# EAGLE design ILX544A_V1_B2 (EAGLE 7.0.0)
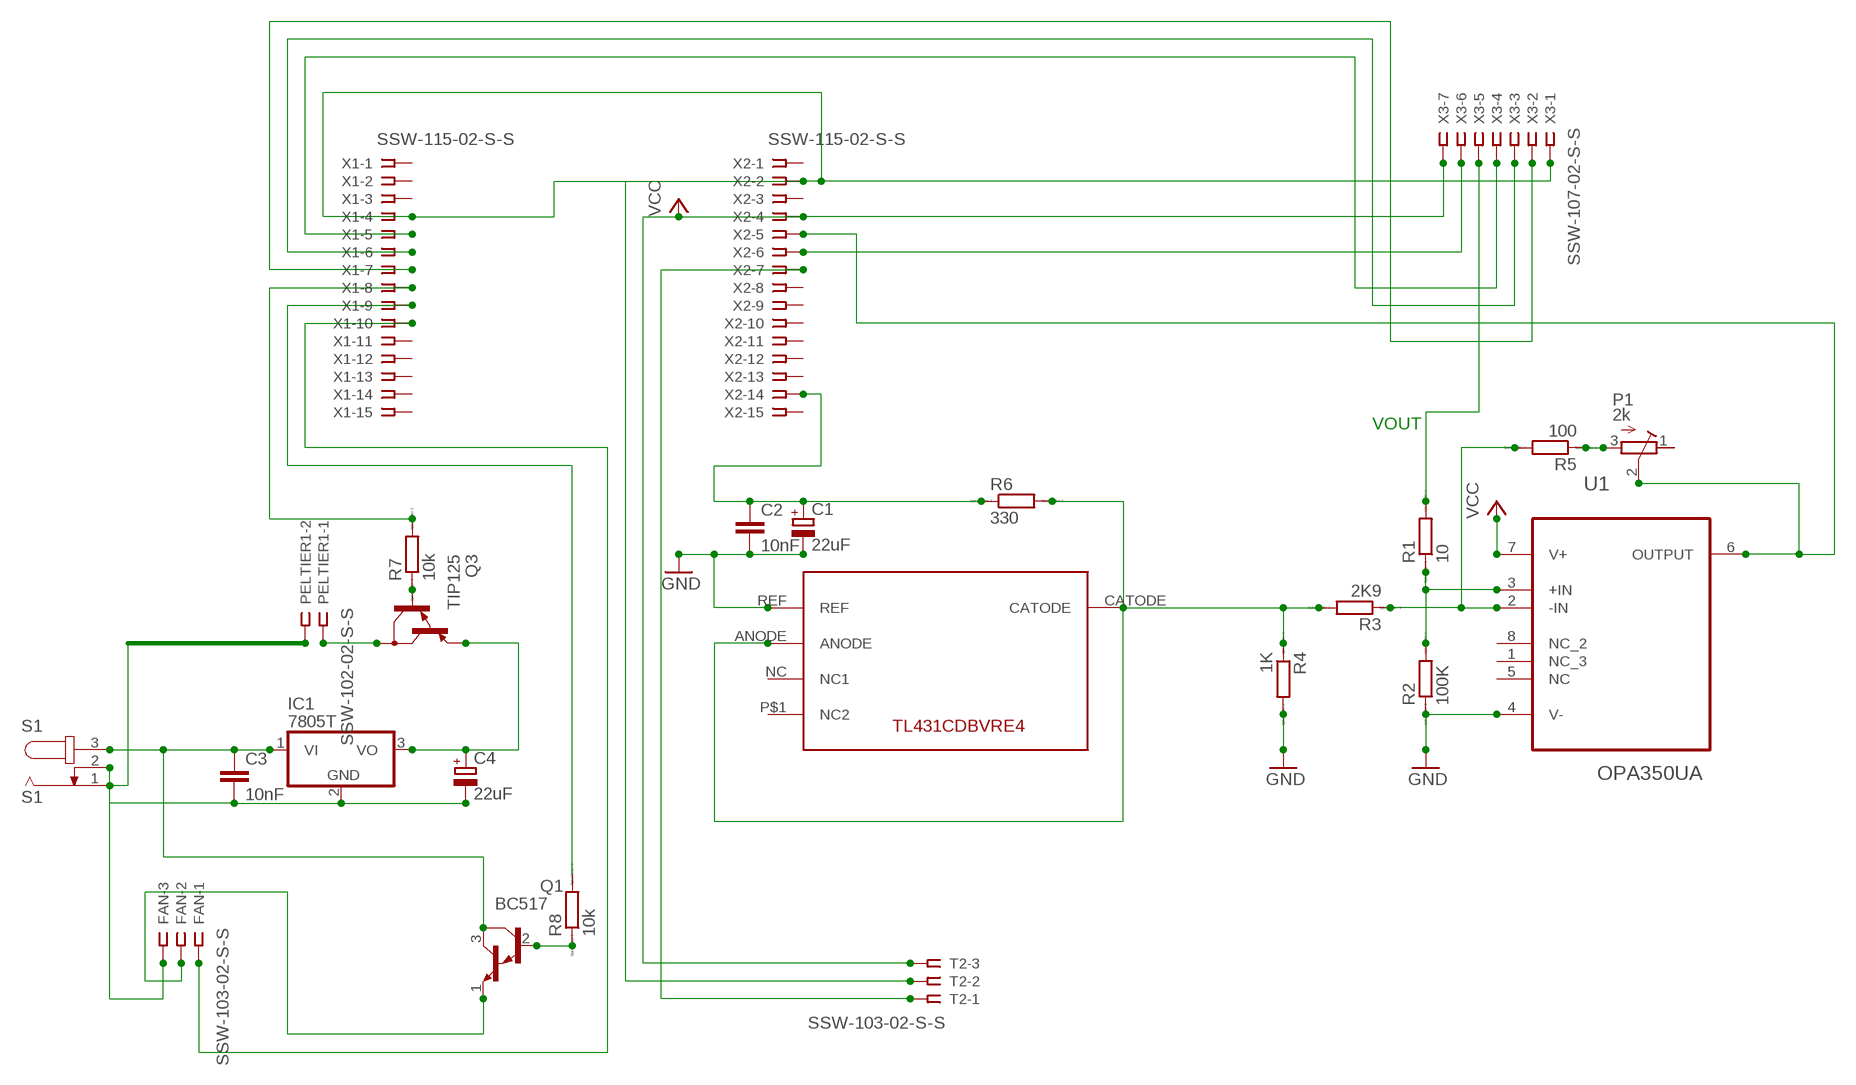
[diagram p0: schematic, sheet 1]

## Parts
C1  22uF  CPOL-EU153CLV-0505  [153CLV-0505]
C2  10nF  C-EUC0402  [C0402]
C3  10nF  C-EUC0402  [C0402]
C4  22uF  CPOL-EU153CLV-0505  [153CLV-0505]
FAN  SSW-103-02-S-S  [SSW-103-02-S-S]
IC1  7805T  [TO220H]
P1  2k  R-TRIMM43P  [RTRIM43P]
PELTIER1  SSW-102-02-S-S  [SSW-102-02-S-S]
Q1  BC517  [TO92]
Q3  TIP125  [TO220]
R1  10  RR1206  [R1206]
R2  100K  RR1206  [R1206]
R3  2K9  RR1206  [R1206]
R4  1K  RR1206  [R1206]
R5  100  RR1206  [R1206]
R6  330  RR1206  [R1206]
R7  10k  RR1206  [R1206]
R8  10k  RR1206  [R1206]
S1  S1  JACK-PLUG0  [SPC4077]
T2  SSW-103-02-S-S  [SSW-103-02-S-S]
U1  OPA350UA  [SOIC127P600X175-8N]
U$1  TL1  TL431CDBVRE4  [TL431CDBVRE4]
X1  SSW-115-02-S-S  [SSW-115-02-S-S]
X2  SSW-115-02-S-S  [SSW-115-02-S-S]
X3  SSW-107-02-S-S  [SSW-107-02-S-S]

## Nets
GND: C1.- C2.2 R2.1 R4.2 U1.4(V-) U$1.REF
N$1: P1.3(E) R5.1
N$2: R3.1 R5.2 U1.2(-IN)
N$3: R1.1 R2.2 U1.3(+IN)
N$6: R3.2 R4.1 R6.2 U$1.ANODE U$1.CATODE
N$7: P1.2(S) U1.6(OUTPUT) X2.5
N$8: C3.1 IC1.1(VI) Q1.3(C) S1.3
N$9: C4.+ IC1.3(VO) Q3.3(E)
N$10: R1.2 X3.5
N$11: PELTIER1.1 Q3.2(C)
N$13: C3.2 C4.- FAN.3 IC1.2(GND) PELTIER1.2 S1.1 S1.2
N$14: X2.6 X3.6
N$16: Q3.1(B) R7.1
N$17: X1.5 X3.4
N$18: X1.6 X3.3
N$19: X1.7 X3.2
N$20: C1.+ C2.1 R6.1 X2.14
N$22: FAN.2 Q1.1(E)
N$23: R7.2 X1.8
N$24: FAN.1 X1.10
N$25: Q1.2(B) R8.1
N$26: R8.2 X1.9
N$29: T2.2 X1.4 X2.2 X3.1
N$30: T2.1 X2.7
VCC: T2.3 U1.7(V+) X2.4 X3.7
Unconnected: P1.1(A) U1.1(NC_3) U1.5(NC) U1.8(NC_2) U$1.NC(NC1) U$1.P$1(NC2) X1.1 X1.2 X1.3 X1.11 X1.12 X1.13 X1.14 X1.15 X2.1 X2.3 X2.8 X2.9 X2.10 X2.11 X2.12 X2.13 X2.15

## Notes on the sheet
- VOUT

## Library data of the parts
C1 C4 = resistor:CPOL-EU: POLARIZED CAPACITOR, European symbol
C2 C3 = rcl:C-EU: CAPACITOR, European symbol
FAN T2 = con-samtec:SSW-103-02-S-S: THROUGH-HOLE .025" SQ POST SOCKET Source: Samtec SSW.pdf; MPN: SSW-103-02-S-S; OC_FARNELL: unknown; OC_NEWARK: 11P9367
IC1 = linear:78*: Positive VOLTAGE REGULATOR Source: http://cache.national.com/ds/LM/LM78L05.pdf http://www.fairchildsemi.com/ds/LM/LM7805.pdf
P1 = resistor:R-TRIMM: Trimm resistor
PELTIER1 = con-samtec:SSW-102-02-S-S: THROUGH-HOLE .025" SQ POST SOCKET Source: Samtec SSW.pdf; MPN: SSW-102-02-S-S; OC_FARNELL: unknown; OC_NEWARK: 11P9351
Q1 = transistor-npn:BC517*: NPN Darlington Transistor
Q3 = transistor-pnp:TIP125: PNP Transistor
R1-R8 = eagle-ltspice:R: RESISTOR, European symbol; SPICEMODEL: NONE; SPICEPREFIX: R
S1 = con-jack:JACK-PLUG: DC POWER JACK Power Jack, DC, Right Angle, Through Hole, Rated 5A at 16VDC, PC Terminals Distributor: Farnell (www.Farnell.de) Drawing: 84N1161.pdf / 84N1162.pdf Manufacturer: SPC Technology (www.spctechnology.com) Type: SPC4077 / SPC 4078; OC_FARNELL: unknown; OC_NEWARK: unknown
U1 = opa350ua:OPA350UA: High-Speed, Single-Supply, Rail-to-Rail OPERATIONAL AMPLIFIERS MicroAmplifier Series; MPN: OPA350UA; OC_FARNELL: 1106197; OC_NEWARK: 35C1894; PACKAGE: SOIC-8; SUPPLIER: Texas Instruments
U$1 = TL431CDVBRE4:TL431CDBVRE4
X1 X2 = con-samtec:SSW-115-02-S-S: THROUGH-HOLE .025" SQ POST SOCKET Source: Samtec SSW.pdf; MPN: SSW-115-02-S-S; OC_FARNELL: unknown; OC_NEWARK: 11P9564
X3 = con-samtec:SSW-107-02-S-S: THROUGH-HOLE .025" SQ POST SOCKET Source: Samtec SSW.pdf; MPN: SSW-107-02-S-S; OC_FARNELL: unknown; OC_NEWARK: 11P9433

## Board
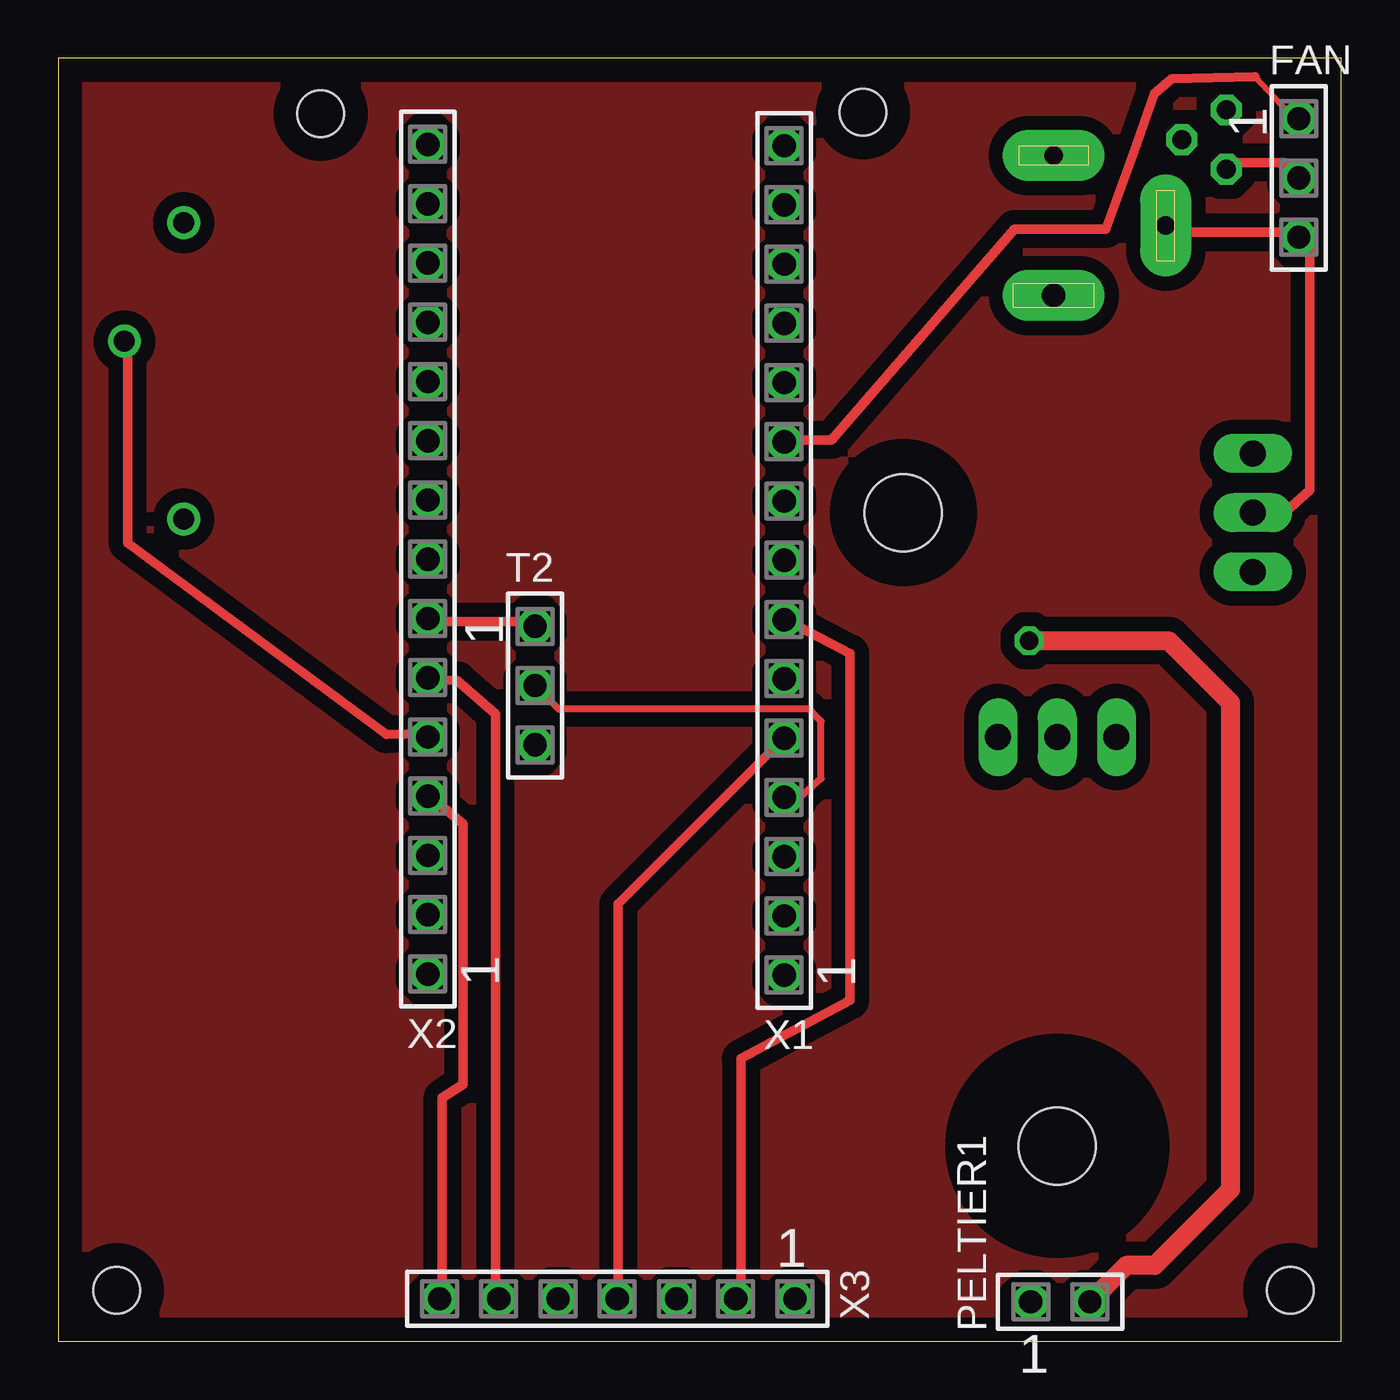
[diagram p1: board, top side]
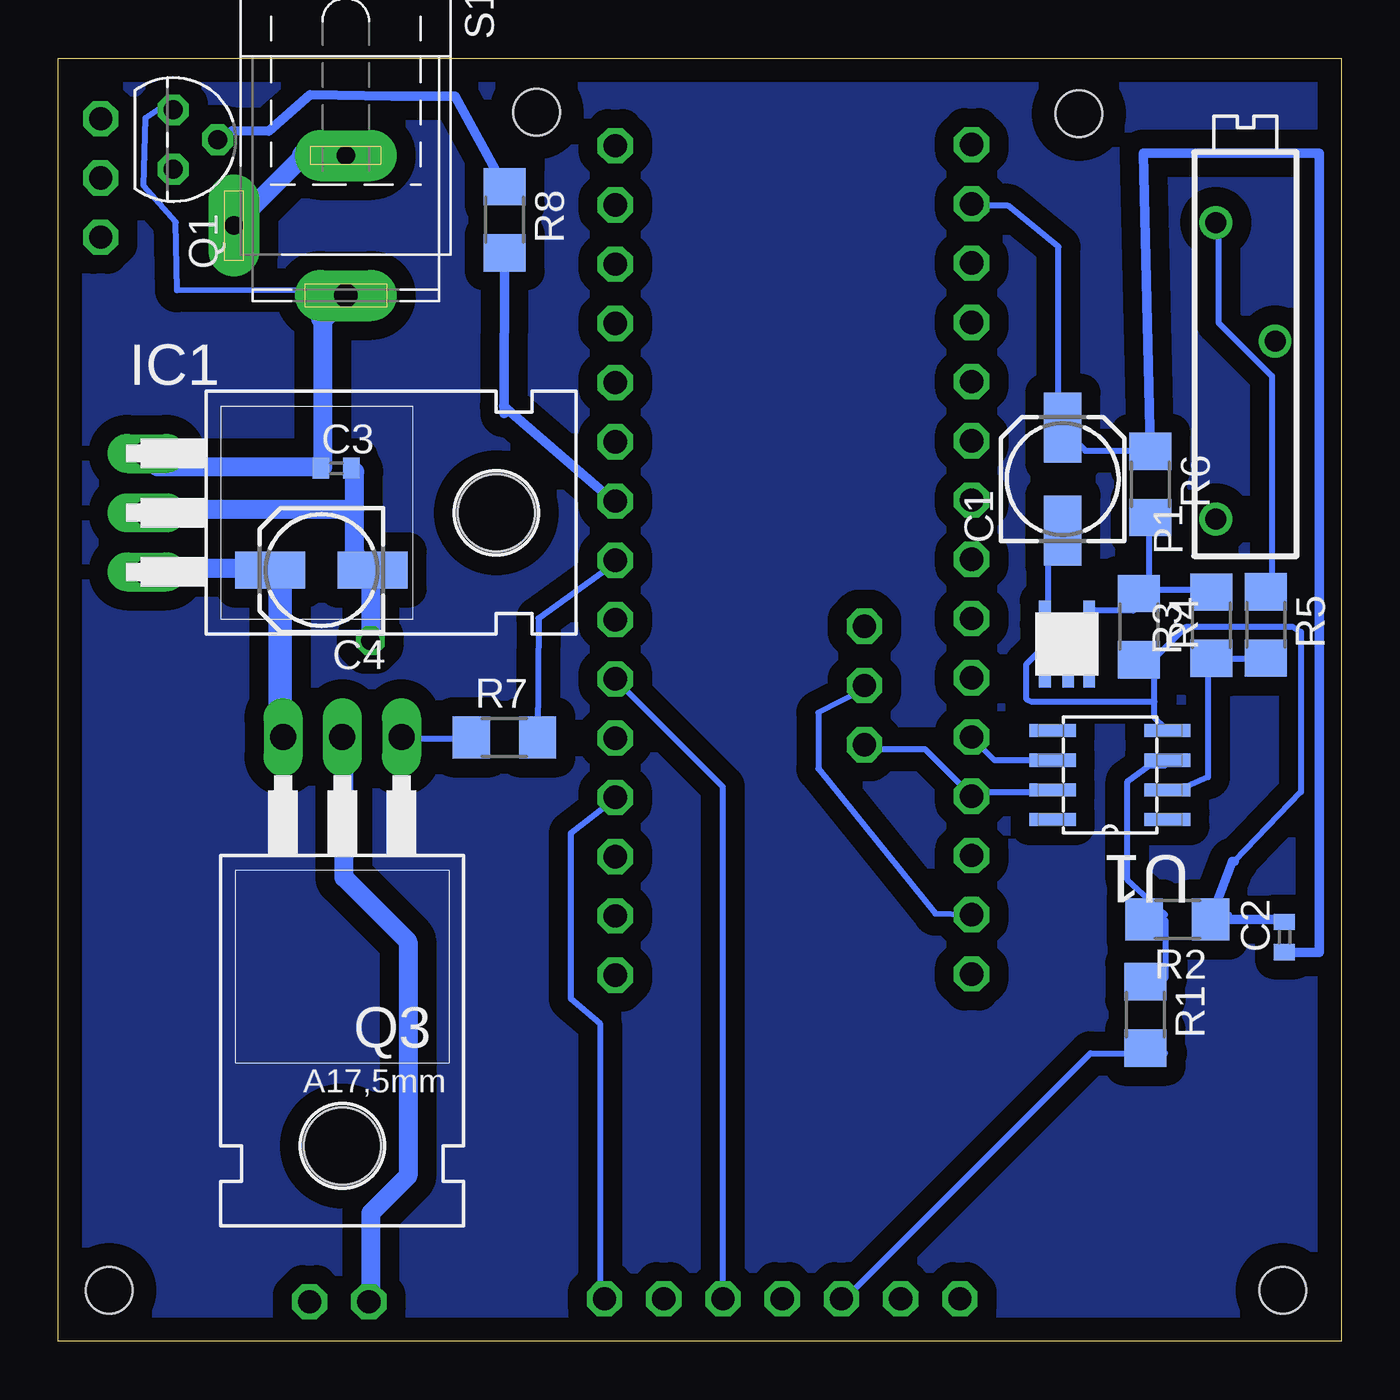
[diagram p2: board, bottom side, seen from below]

Size 55 x 55 mm. Coordinates in mm from the lower left corner, seen from the top.
Outline: 0,0 55,0 55,55 0,55 0,0
Copper layers (1*16): Top 0.035mm / dielectric 1.5mm / Bottom 0.035mm
Design rules "default": minimum track width 10mil, minimum drill 24mil, track to track 8mil, track to pad 8mil, pad to pad 8mil, via to via 8mil, smd to smd 8mil, copper to edge 40mil, drill to drill 8mil, minimum pad ring 10mil, minimum via ring 8mil, stop-mask expansion 4mil, vias tented up to drill 0mil, thermal gap 10mil
Holes 2 mm at 2.5,2.19 52.81,2.19 11.25,52.62 34.5,52.69

### Footprints (pad centres in the part's own frame; a part is rotated, then mirrored left to right if it is on the bottom)
153CLV-0505 = smd 3 x 1.6: + 2.2,0; - -2.2,0
C0402 = smd 0.7 x 0.9: 1 -0.65,0; 2 0.65,0
SSW-103-02-S-S = drill 1 pad 1.5 octagon: 1 -2.54,0; 2 0,0; 3 2.54,0
TO220H = drill 1.118 long: 1 -2.54,-10.16; 2 0,-10.16; 3 2.54,-10.16 | hole 3.302: 0,4.826
RTRIM43P = drill 0.9: 1 -7.62,1.27; 2 0,-1.27; 3 5.08,1.27
SSW-102-02-S-S = drill 1 pad 1.5 octagon: 1 -1.27,0; 2 1.27,0
TO92 = drill 0.813 octagon: 1 1.27,0; 2 0,1.905; 3 -1.27,0
TO220 = drill 1.118 long: 1 -2.54,-6.35; 2 0,-6.35; 3 2.54,-6.35 | hole 3.302: 0,11.176
R1206 = smd 1.6 x 1.803: 1 -1.422,0; 2 1.422,0
SPC4077 = drill 0.8 pad 2.184 long: 1 -3,0; 2 0,-4.8 | drill 1 pad 2.184 long: 3 3,0
SOIC127P600X175-8N = smd 1.981 x 0.559: 1 -2.464,1.905; 2 -2.464,0.635; 3 -2.464,-0.635; 4 -2.464,-1.905; 5 2.464,-1.905; 6 2.464,-0.635; 7 2.464,0.635; 8 2.464,1.905
TL431CDBVRE4 = smd 0.508 x 1.016: ANODE 1.2,0.5; CATODE 2.1,3.2; NC 2.1,0.5; P$1 0.2,0.5; REF 0.2,3.2
SSW-115-02-S-S = drill 1 pad 1.5 octagon: 1 -17.78,0; 2 -15.24,0; 3 -12.7,0; 4 -10.16,0; 5 -7.62,0; 6 -5.08,0; 7 -2.54,0; 8 0,0; 9 2.54,0; 10 5.08,0; 11 7.62,0; 12 10.16,0; 13 12.7,0; 14 15.24,0; 15 17.78,0
SSW-107-02-S-S = drill 1 pad 1.5 octagon: 1 -7.62,0; 2 -5.08,0; 3 -2.54,0; 4 0,0; 5 2.54,0; 6 5.08,0; 7 7.62,0

### Placement (x,y rotation side)
C1  11.94,36.96 90 bottom
C2  2.43,17.32 90 bottom
C3  43.09,37.43 0 bottom
C4  43.72,33.06 180 bottom
FAN  53.19,49.87 270 top
IC1  41.05,35.52 270 bottom
P1  4.11,42.87 90 bottom
PELTIER1  42.96,1.69 0 top
Q1  50.07,51.52 270 bottom
Q3  42.83,19.55 180 bottom
R1  8.39,13.99 270 bottom
R2  7.03,18.08 180 bottom
R3  5.58,30.7 90 bottom
R4  8.68,30.63 270 bottom
R5  3.24,30.71 270 bottom
R6  8.18,36.73 270 bottom
R7  330  [R1206]  35.87,25.89 0 bottom
R8  330  [R1206]  35.86,48.08 270 bottom
S1  42.68,47.84 270 bottom
T2  20.44,28.11 270 top
U1  9.91,24.27 180 bottom
U$1  12.91,28.04 0 bottom
X1  31.12,33.48 90 top
X2  15.84,33.52 90 top
X3  23.96,1.81 180 top

### Tracks (layer width: path | path; a pad name or v marks a point on that pad's centre or on a via)
GND
  Bottom 0.254: C1.- 12.12,34.75 12.57,34.29 12.57,31.32 U$1.REF 12.8,31.09 12.8,29.72 13.49,29.03 13.49,27.51 13.26,27.41 8,27.41 | 4.8,18.29 R2.1 | 8,27.41 8,26.75 7.54,26.29 U1.4 | 8,27.41 8,29.03 R4.2 8,29.26 6.63,30.63 2.08,30.63 1.73,30.4 1.73,23.55 4.57,20.57
  Bottom 0.406: 4.57,20.57 4.67,20.57 R2.1 2.43,18.08 C2.2
N$1
  Bottom 0.254: R5.1 2.97,32.23 2.97,41.38 5.26,43.66 5.26,47.78 P1.3
N$2
  Bottom 0.254: R5.2 2.97,29.26 5.49,29.26 R3.1 5.71,29.26 5.71,24.19 6.63,23.77 7.32,23.77 U1.2
N$3
  Bottom 0.254: R1.1 7.54,15.54 7.54,18.06 R2.2 7.54,18.29 9.16,19.79 9.16,24 8.23,24.69 7.54,24.69 U1.3
N$4
  pour Bottom (isolate 0.813): 0,55 55,55 55,-0.31 0,-0.31
N$6
  Bottom 0.254: R4.1 8.23,32 8.91,31.32 10.74,31.32 U$1.CATODE 10.97,31.09 11.66,30.4 11.66,28.57 U$1.ANODE | R3.2 5.71,32.23 8,32.23 R4.1 | R6.2 8.23,35.2 8.23,32.23 R4.1
N$7
  Top 0.254: 2.97,42.75 P1.2 | 15.77,26.06 X2.5
  Top 0.406: 2.97,42.75 2.97,34.22 14.07,26.02 15.77,26.06
  Bottom 0.254: U1.6 12.57,24.92 14.86,24.92 15.77,25.83 X2.5
N$8
  Bottom 0.254: 51.21,37.95 50.75,37.49 | 43.89,37.49 C3.1 43.66,37.49 | Q1.3 50.06,53.26 51.26,52.45 51.34,49.52 49.96,47.97 49.91,45.06 42.75,45.03 S1.3 42.75,44.81
  Bottom 0.813: 50.75,37.49 43.89,37.49 | 43.66,43.89 43.66,37.49
  Bottom 1.016: 51.21,37.95 IC1.1 | 42.75,44.81 43.66,43.89
N$9
  Bottom 0.254: 45.95,33.15 C4.+ 45.72,32.92 45.49,32.69 | 51.21,33.15 IC1.3 | 45.49,26.06 Q3.3
  Bottom 0.813: 51.21,33.15 45.95,33.15
  Bottom 1.016: 45.49,32.69 45.49,26.06
N$10
  Bottom 0.254: R1.2 7.54,12.34 10.74,12.34 21.26,1.83 X3.5
N$11
  Bottom 0.254: 41.6,1.83 PELTIER1.1 | 42.75,25.83 Q3.2
  Bottom 0.406: 42.75,25.82 Q3.2
  Bottom 0.813: 41.6,1.83 41.6,5.49 40.01,7.09 40.01,17.13 42.75,19.88 42.75,25.82
N$12
  pour Top (isolate 0.61): 0.31,54.69 54.38,54.69 54.38,0.31 0.31,0.31
N$13  (via drill 0.8)
  Top 0.254: 47.78,47.55 47.55,47.78 S1.2 | 53.03,47.55 FAN.3 53.66,47.32 | 52.63,35.56 IC1.2
  Top 0.406: 47.78,47.55 53.03,47.55 | 53.66,47.32 53.66,36.49 52.63,35.56
  Top 0.813: v41.62,30.03 47.6,30.03 50.25,27.38 50.25,6.5 47,3.25 45.79,3.25 PELTIER1.2
  Bottom 0.254: 42.29,33.83 41.6,33.15 C4.- 41.6,32.92 | 42.29,37.26 C3.2 42.29,37.49 | 44.35,1.83 PELTIER1.2 | 51.21,35.66 IC1.2
  Bottom 0.813: 42.29,33.83 42.29,35.66 | 42.29,35.66 42.29,37.26 | 41.6,32.92 v41.62,30.03 | 42.29,35.66 51.21,35.66 | 44.48,50.84 S1.2
  Bottom 1.016: S1.1 44.48,50.84
N$14
  Top 0.254: 16,28.35 X2.6 | 18.75,1.83 X3.6
  Top 0.406: 16,28.35 17.1,28.33 18.75,26.89 18.75,1.83
N$16
  Bottom 0.254: R7.1 37.45,25.83 40.23,25.83 Q3.1
N$17
  Top 0.254: 24,1.83 X3.4 | 31.09,25.83 X1.5
  Top 0.406: 24,1.83 24,18.75 31.09,25.83
N$18
  Bottom 0.254: X3.3 26.52,1.83 26.52,23.77 31.09,28.35 X1.6
N$19
  Top 0.254: 29.26,1.83 X3.2 | 31.32,30.86 X1.7
  Top 0.406: 29.26,1.83 29.26,12.12 33.95,14.61 33.95,29.49 31.32,30.86
N$20
  Bottom 0.254: R6.1 8.23,38.18 10.97,38.18 11.89,39.09 C1.+ 12.12,39.32 12.12,46.92 14.27,48.68 15.77,48.69 X2.14
  Bottom 0.406: C2.1 0.94,16.68 0.94,50.94 8.49,50.94 R6.1
N$22
  Top 0.254: 53.03,50.06 52.58,50.52 | 50.29,50.52 Q1.1
  Top 0.406: 52.58,50.52 50.29,50.52 | 53.03,50.06 FAN.2
N$23
  Bottom 0.254: R7.2 34.41,30.99 31.09,33.38 X1.8
N$24
  Top 0.254: 53.03,52.35 51.31,54.22 | 31.32,38.63 X1.10
  Top 0.406: 31.32,38.63 33.15,38.63 40.99,47.68 44.92,47.68 46.12,50.98 46.99,53.48 47.73,54.12 51.31,54.22 | 53.03,52.35 FAN.1
N$25
  Bottom 0.254: 47.55,51.89 48.01,51.89 Q1.2
  Bottom 0.406: 47.55,51.89 45.97,51.88 44.2,53.44 40.7,53.37 37.99,53.37 R8.1
N$26
  Bottom 0.254: 35.91,40.09 35.89,39.78 | 31.32,36.12 X1.9
  Bottom 0.406: 31.32,36.12 35.91,40.09 | 35.89,39.78 R8.2
N$29
  Top 0.305: X1.4 31.77,23.32 32.7,24.12 32.7,26.57 32.17,27.1 21.45,27.1 T2.2
  Bottom 0.254: X2.2 16,18.29 17.4,18.33 22.42,24.55 22.42,26.95 20.57,27.89 T2.2 | X3.1 31.77,1.83 31.77,13.63 33.03,14.69 33.03,21.77 31.32,23.09 X1.4
N$30
  Top 0.254: 20.34,30.86 T2.1 | 16,30.86 X2.7
  Top 0.406: 16,30.86 20.34,30.86
VCC
  Top 0.254: 16.46,1.83 X3.7 | 16,23.32 X2.4
  Top 0.406: 16.46,1.83 16.46,10.43 17.34,11.02 17.34,22.17 16,23.32
  Bottom 0.254: U1.7 12.57,23.55 15.77,23.55 X2.4 16,23.55 17.83,25.38 20.34,25.38 T2.3